# EAGLE design dip20_a1 (EAGLE 5.11)
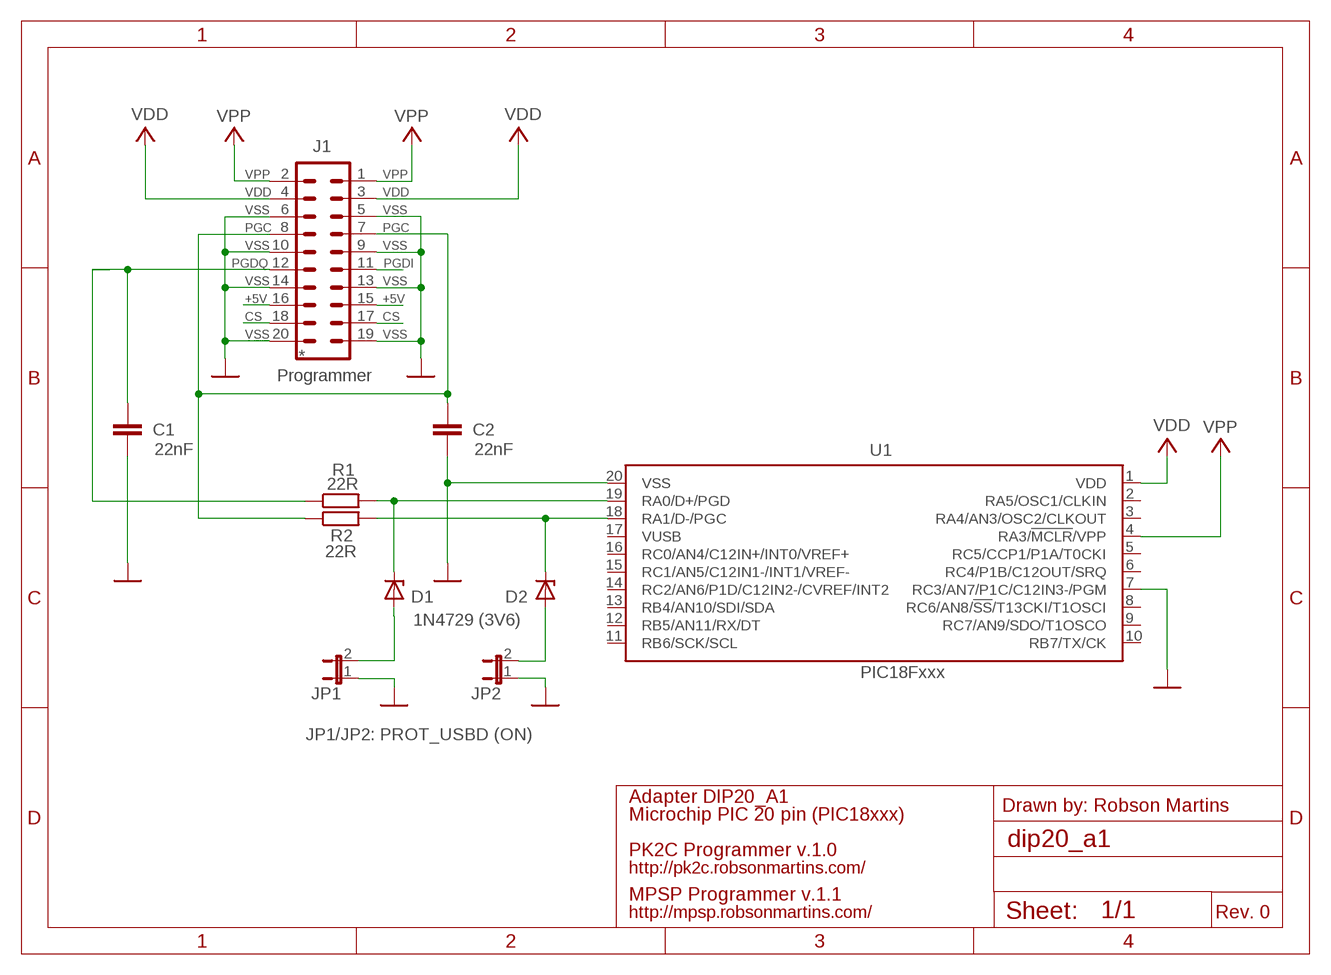
[diagram p0: schematic, sheet 1]

## Parts
C1  22nF  C-EU025-025X050  [C025-025X050]
C2  22nF  C-EU025-025X050  [C025-025X050]
D1  1N4729 (3V6)  ZENER-DIODEDO41Z10  [DO41Z10]
D2  ZENER-DIODEDO41Z10  [DO41Z10]
J1  Programmer  MA10-2  [MA10-2]
JP1  JP1E  [JP1]
JP2  JP1E  [JP1]
R1  22R  R-EU_0204/7  [0204/7]
R2  22R  R-EU_0204/7  [0204/7]
U1  PIC18Fxxx  PIC18F1XK50  [DIL20]

## Nets
+5V: J1.15 J1.16
CS: J1.17 J1.18
GND: C1.2 C2.2 J1.5 J1.6 J1.9 J1.10 J1.13 J1.14 J1.19 J1.20 JP1.1 JP2.1 U1.7(RC3/AN7/P1C/C12IN3-/PGM) U1.20(VSS)
PGC: C2.1 J1.7 J1.8 R2.1
PGC_CHIP: D2.C R2.2 U1.18(RA1/D-/PGC)
PGC_PROT: D2.A JP2.2
PGD: C1.1 J1.12 R1.1
PGD_CHIP: D1.C R1.2 U1.19(RA0/D+/PGD)
PGD_PROT: D1.A JP1.2
PGDI: J1.11
VDD: J1.3 J1.4 U1.1(VDD)
VPP: J1.1 J1.2 U1.4(RA3/!MCLR!/VPP)
Unconnected: U1.2(RA5/OSC1/CLKIN) U1.3(RA4/AN3/OSC2/CLKOUT) U1.5(RC5/CCP1/P1A/T0CKI) U1.6(RC4/P1B/C12OUT/SRQ) U1.8(RC6/AN8/!SS!/T13CKI/T1OSCI) U1.9(RC7/AN9/SDO/T1OSCO) U1.10(RB7/TX/CK) U1.11(RB6/SCK/SCL) U1.12(RB5/AN11/RX/DT) U1.13(RB4/AN10/SDI/SDA) U1.14(RC2/AN6/P1D/C12IN2-/CVREF/INT2) U1.15(RC1/AN5/C12IN1-/INT1/VREF-) U1.16(RC0/AN4/C12IN+/INT0/VREF+) U1.17(VUSB)

## Notes on the sheet
- VPP | VPP
- VDD | VDD
- VSS | VSS
- PGC | PGC
- VSS | VSS
- PGDQ | PGDI
- VSS | VSS
- +5V | +5V
- CS | CS
- VSS | VSS
- *
- JP1/JP2: PROT_USBD (ON)
- Adapter DIP20_A1
- Drawn by: Robson Martins
- Microchip PIC 20 pin (PIC18xxx)
- PK2C Programmer v.1.0
- http://pk2c.robsonmartins.com/
- MPSP Programmer v.1.1
- http://mpsp.robsonmartins.com/ | Rev. 0

## Library data of the parts
C1 C2 = rcl:C-EU: CAPACITOR, European symbol
D1 D2 = diode:ZENER-DIODE: Z-Diode
J1 = con-lstb:MA10-2: PIN HEADER; OC_FARNELL: unknown; OC_NEWARK: unknown
JP1 JP2 = jumper:JP1E: JUMPER
R1 R2 = resistor:R-EU_: RESISTOR, European symbol
U1 = microchip:PIC18F1XK50

## Board
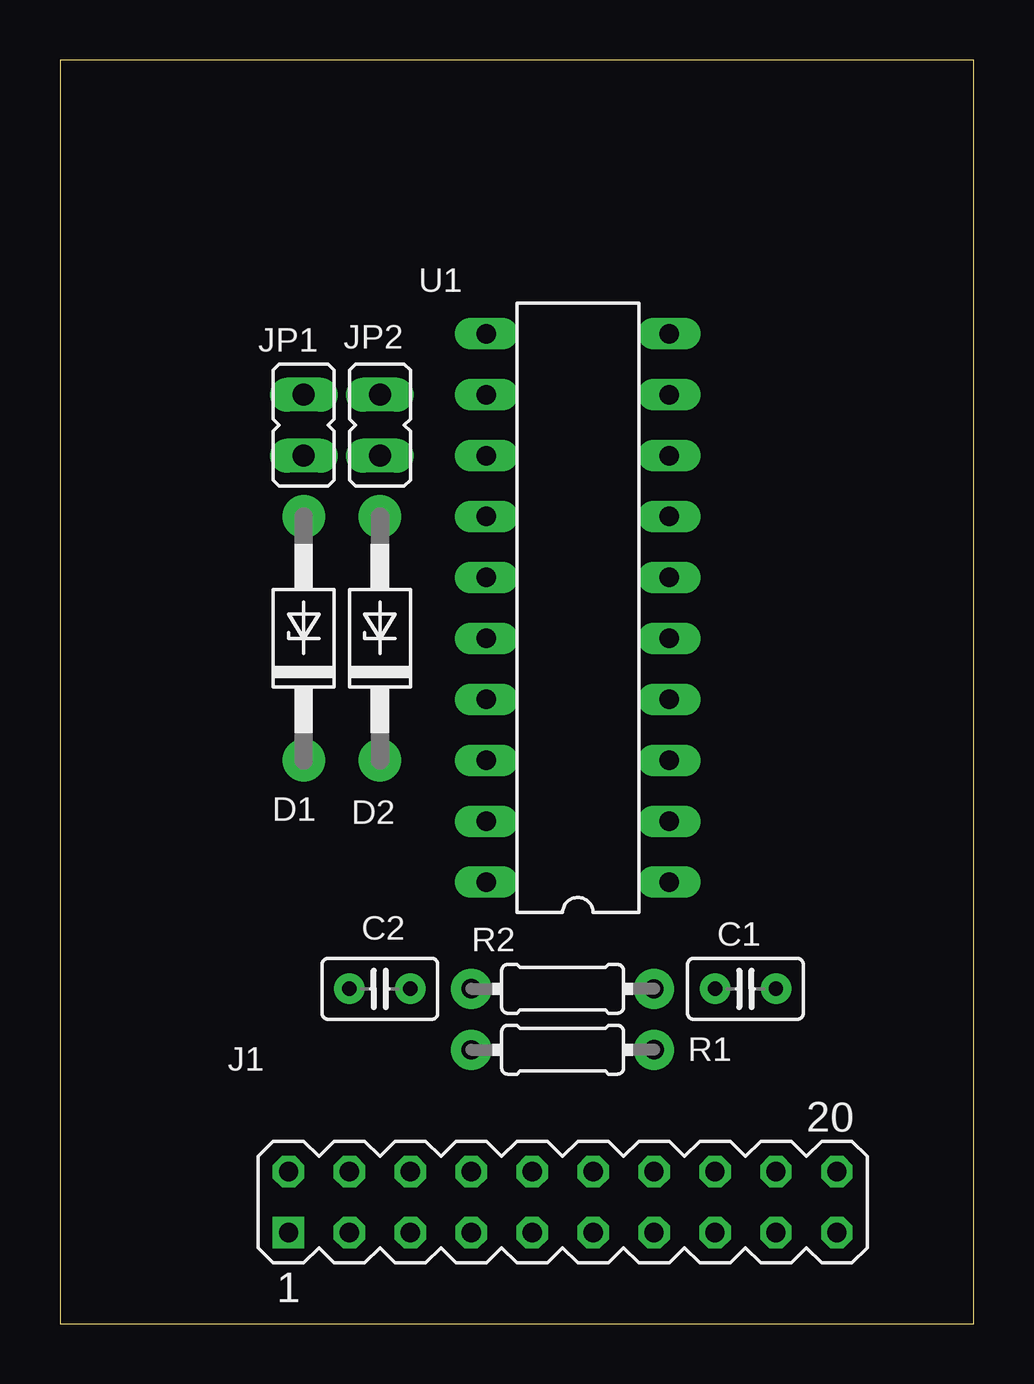
[diagram p1: board, top side]
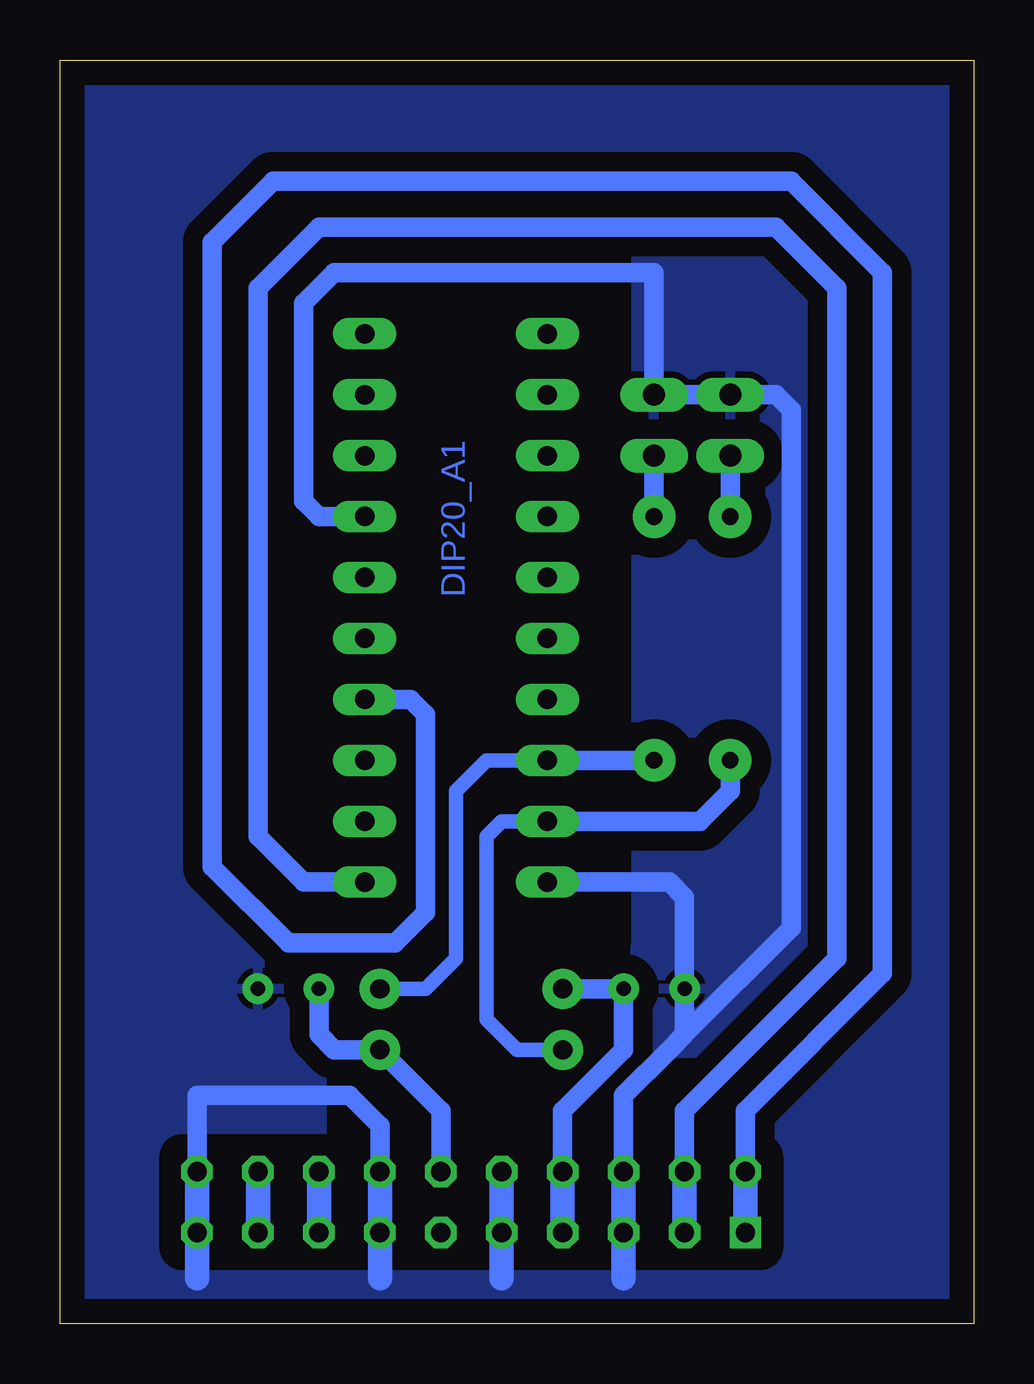
[diagram p2: board, bottom side, seen from below]

Size 38.1 x 52.69 mm. Coordinates in mm from the lower left corner, seen from the top.
Outline: 38.1,0 38.1,52.69 0,52.69 0,0 38.1,0
Copper layers (1*16): Top 0.035mm / dielectric 1.5mm / Bottom 0.035mm
Design rules "default": minimum track width 10mil, minimum drill 24mil, track to track 8mil, track to pad 8mil, pad to pad 8mil, via to via 8mil, smd to smd 8mil, copper to edge 40mil, drill to drill 8mil, minimum pad ring 10mil, minimum via ring 8mil, stop-mask expansion 4mil, vias tented up to drill 0mil, thermal gap 10mil
bRestrict: area 8.9,3.2 to 33,10.2; area 15.2,15.9 to 31.8,45.1

### Footprints (pad centres in the part's own frame; a part is rotated, then mirrored left to right if it is on the bottom)
C025-025X050 = drill 0.6 pad 1.27 round: 1 -1.27,0; 2 1.27,0
DO41Z10 = drill 0.7 pad 1.778 round: A 5.08,0; C -5.08,0
MA10-2 = drill 0.8 pad 1.27 square: 1 -11.43,-1.27 | drill 0.8 pad 1.27 octagon: 2 -11.43,1.27; 3 -8.89,-1.27; 4 -8.89,1.27; 5 -6.35,-1.27; 6 -6.35,1.27; 7 -3.81,-1.27; 8 -3.81,1.27; 9 -1.27,-1.27; 10 -1.27,1.27; 11 1.27,-1.27; 12 1.27,1.27; 13 3.81,-1.27; 14 3.81,1.27; 15 6.35,-1.27; 16 6.35,1.27; 17 8.89,-1.27; 18 8.89,1.27; 19 11.43,-1.27; 20 11.43,1.27
JP1 = drill 0.914 long: 1 0,-1.27; 2 0,1.27
0204/7 = drill 0.813 pad 1.676 round: 1 -3.81,0 | drill 0.8 pad 1.676 round: 2 3.81,0
DIL20 = drill 0.813 long: 1 -11.43,-3.81; 2 -8.89,-3.81; 3 -6.35,-3.81; 4 -3.81,-3.81; 5 -1.27,-3.81; 6 1.27,-3.81; 7 3.81,-3.81; 8 6.35,-3.81; 9 8.89,-3.81; 10 11.43,-3.81; 11 11.43,3.81; 12 8.89,3.81; 13 6.35,3.81; 14 3.81,3.81; 15 1.27,3.81; 16 -1.27,3.81; 17 -3.81,3.81; 18 -6.35,3.81; 19 -8.89,3.81; 20 -11.43,3.81

### Placement (x,y rotation side)
C1  28.58,13.97 0 top
C2  13.34,13.97 180 top
D1  10.16,28.57 90 top
D2  13.34,28.57 90 top
J1  20.96,5.08 0 top
JP1  10.16,37.47 180 top
JP2  13.34,37.47 180 top
R1  20.96,11.43 180 top
R2  20.96,13.97 0 top
U1  21.59,29.84 90 top

### Tracks (layer width: path | path; a pad name or v marks a point on that pad's centre or on a via)
+5V
  Bottom 1.016: J1.15 J1.16
CS
  Bottom 1.016: J1.17 J1.18
GND
  Bottom 0.813: J1.14 24.77,8.26 26.04,9.53 32.39,9.53 J1.20 | J1.6 14.61,8.89 14.61,9.53 12.7,11.43 12.07,12.06 | U1.7 27.31,33.66 27.94,34.29 27.94,41.91 27.94,42.55 26.67,43.81 15.88,43.81 15.24,43.81 13.34,43.81 JP2.1 JP1.1 8.26,38.73 7.62,38.1 7.62,16.51 12.07,12.06 | U1.20 12.7,18.41 12.07,17.78 12.07,12.06
  Bottom 1.016: J1.6 J1.5 14.61,1.91 | J1.10 J1.9 19.69,1.91 | J1.14 J1.13 24.77,1.91 | J1.20 J1.19 32.39,1.91
  pour Bottom (isolate 0.813): 38.1,0 0,0 0,52.7 38.1,52.7
PGC
  Bottom 0.813: J1.8 17.15,7.62 17.15,8.89 14.61,11.43 C2.1 R2.1
  Bottom 1.016: J1.7 J1.8
PGC_CHIP
  Bottom 0.61: R2.2 22.86,13.97 21.59,15.24 21.59,22.23 20.32,23.5 U1.18
  Bottom 0.813: D2.C U1.18
PGC_PROT
  Bottom 0.813: D2.A JP2.2
PGD
  Bottom 0.813: J1.12 22.23,8.89 R1.1 26.67,11.43 27.31,12.06 C1.1
PGD_CHIP
  Bottom 0.61: U1.19 19.69,20.95 20.32,20.32 20.32,16.51 20.32,12.7 19.05,11.43 R1.2
  Bottom 0.813: U1.19 11.43,20.95 10.16,22.23 D1.C
PGD_PROT
  Bottom 0.813: D1.A JP1.2
VDD
  Bottom 0.813: J1.4 12.07,7.62 12.07,8.89 5.72,15.24 5.72,43.18 8.26,45.72 11.43,45.72 13.97,45.72 27.31,45.72 29.85,43.18 29.85,20.32 27.94,18.41 U1.1
  Bottom 1.016: J1.3 J1.4
VPP
  Bottom 0.813: J1.1 9.53,7.62 9.53,8.89 3.81,14.61 3.81,43.81 7.62,47.62 10.16,47.62 12.7,47.62 29.21,47.62 31.75,45.09 31.75,19.05 28.58,15.88 24.13,15.88 22.86,17.14 22.86,25.4 23.5,26.04 U1.4
  Bottom 1.016: J1.1 J1.2

### Text on the board
Bottom: DIP20_A1
tDocu: Microchip PIC | PIC 18xxx | DIP20_A1 | Adapter | Prot.USBD (ON) | VSS | VPP | VDD | VSS | PGC | VSS | PGD | VSS | +5V | CS